# Altium project Feeder.PrjPcb (part 2 of 2)

## Sheet 07_Power_Supply_AC_to_DC.SchDoc
size A; SheetNumber: 7; SheetTotal: 8
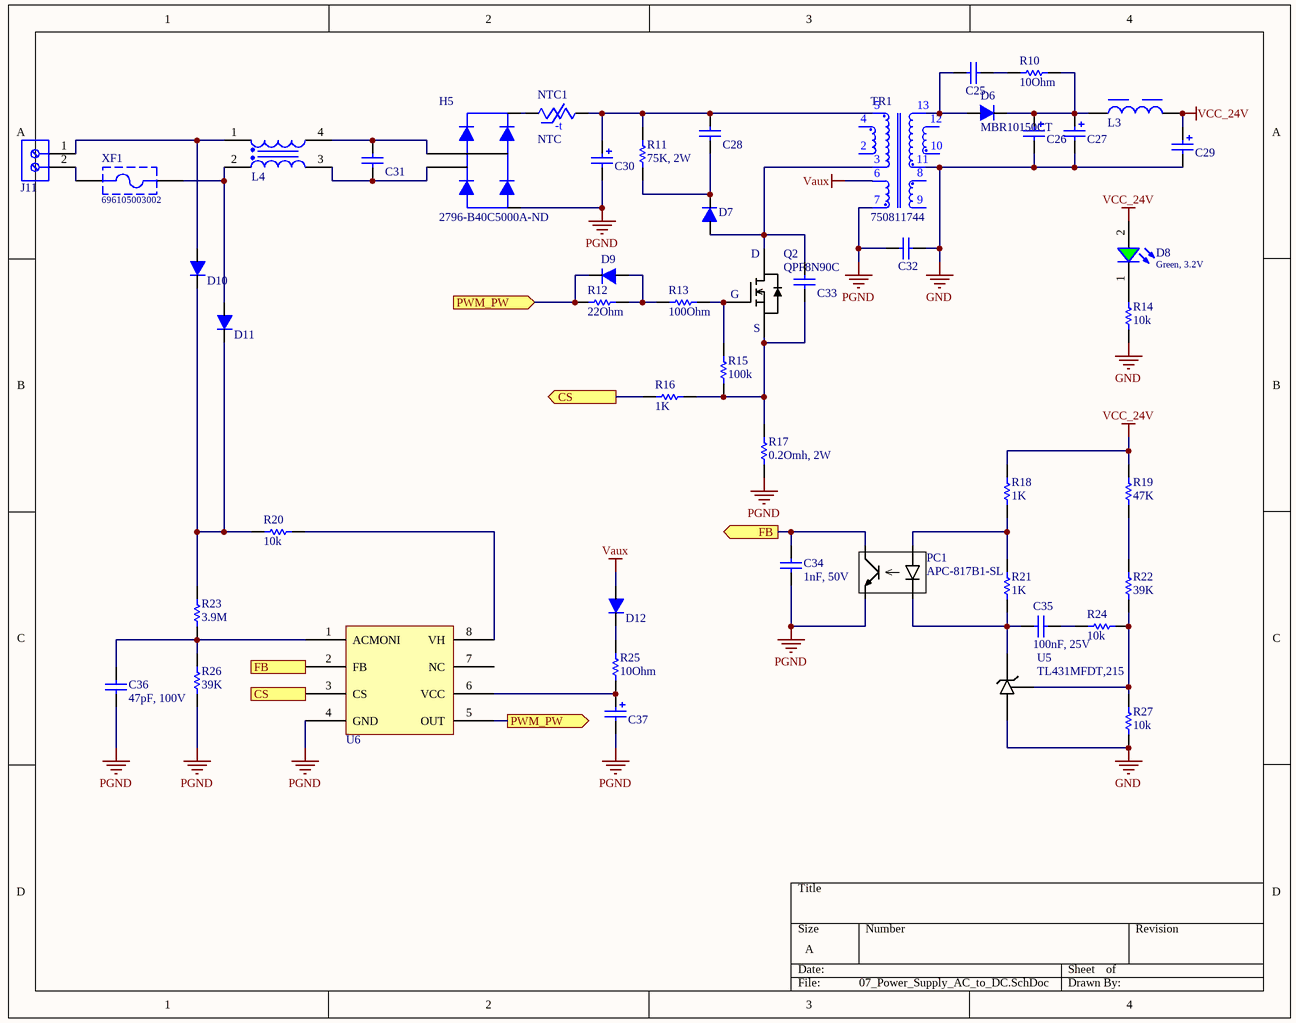
[diagram p6: 07_Power_Supply_AC_to_DC.SchDoc]

### Parts
C25  1nF  [WCAP-CSMH_0805_L2W1.25H0.8_Reflow]  (value not drawn)
C26  1200uF  [WCAP-ATG8_D16H31.5]  (value not drawn)
C27  1200uF  [WCAP-ATG8_D16H31.5]  (value not drawn)
C28  4.7nF  [WCAP-CSMH_1206_L3.2W1.6H1.25]  (value not drawn)
C29  100uF  [WCAP-ATG8_D8H11.5]  (value not drawn)
C30  220uF  [WCAP-AI3H_D22H50]  (value not drawn)
C31  2.2uF  [WCAP-FTX2_L26W15H25]  (value not drawn)
C32  2.2nF  [WCAP-CSSA_2211_L5.7W2.8H2.5]  (value not drawn)
C33  22pF  [WCAP-CSMH_1210_L3.2W2.5H0.95]  (value not drawn)
C34  1nF, 50V  [WCAP-CSGP_0805_H=0.8mm_Reflow]
C35  100nF, 25V  [WCAP-CSGP_0805_H=0.8mm_Reflow]
C36  47pF, 100V  [WCAP-CSGP_0805_H=0.6mm_Reflow]
C37  10uF  [WCAP-ATG8_D5H11]  (value not drawn)
D6  MBR10150CT  [MBR10150CT]
D7  RS1M-13-F  [SMA]  (value not drawn)
D8  Green, 3.2V  [WL-SMCW_0603_H=0.7mm]
D9  CDBA360-HF  [SMA]  (value not drawn)
D10  RFU02VSM8STR  [Flat Lead]  (value not drawn)
D11  RFU02VSM8STR  [Flat Lead]  (value not drawn)
D12  RS1M-13-F  [SMA]  (value not drawn)
H5  2796-B40C5000A-ND  [GBJ-4]
J11  691137710002  [691137710002]  (value not drawn)
L3  10µH, 7A  [WE-LHMI_1040]  (value not drawn)
L4  13mH  [WE-FC_UT20V]  (value not drawn)
NTC1  NTC  [NTC]
PC1  APC-817B1-SL  [APC-817B1-SL]
Q2  QPF8N90C  [FQPF8N90C]
R10  value 10Ohm  [RES-SM-2512]  (hidden comment: RK73H3ATTE10R0D)
R11  value 75K, 2W  [RES-SM-2512]  (hidden comment: 352175KFT)
R12  value 22Ohm  [RES-SM-0805]  (hidden comment: RK73H2ATTD22R0F)
R13  value 100Ohm  [RES-SM-0805]  (hidden comment: RK73B2ATTD101J)
R14  value 10k  [RES-SM-0805]  (hidden comment: RK73H2ATTD1002F)
R15  value 100k  [RES-SM-0805]  (hidden comment: RK73H2ATTD1003F)
R16  value 1K  [RES-SM-0805]  (hidden comment: RK73B2ATTD102J)
R17  value 0.2Omh, 2W  [RES-SM-2010]  (hidden comment: WFMB2010R2000FEA)
R18  value 1K  [RES-SM-0805]  (hidden comment: RK73B2ATTD102J)
R19  value 47K  [RES-SM-0805]  (hidden comment: RK73B2ATTD473J)
R20  value 10k  [RES-SM-0805]  (hidden comment: RK73H2ATTD1002F)
R21  value 1K  [RES-SM-0805]  (hidden comment: RK73B2ATTD102J)
R22  value 39K  [RES-SM-0805]  (hidden comment: RK73B2ATTD393J)
R23  value 3.9M  [RES-SM-0805]  (hidden comment: RK73B2ATTD395J)
R24  value 10k  [RES-SM-0805]  (hidden comment: RK73H2ATTD1002F)
R25  value 10Ohm  [RES-SM-0805]  (hidden comment: RK73H2ATTD10R0F)
R26  value 39K  [RES-SM-0805]  (hidden comment: RK73B2ATTD393J)
R27  value 10k  [RES-SM-0805]  (hidden comment: RK73H2ATTD1002F)
TR1  750811744  [750811744]
U5  TL431MFDT,215  [TO-236AB]
U6  BM1P061FJ-E2  [SOP-J8]  (value not drawn)
XF1  696105003002  [696105003002]

### Ports
CS (in), CS (out), FB (in), FB (out), PWM_PW (in), PWM_PW (out)

### Nets
GND: C26.2(N) C27.2(N) C29.2(N) C32.1 R14.2 R27.2 TR1.11 U5.3
PGND: C30.2(N) C32.2 C34.1 C36.1 C37.2(N) H5.4(-) PC1.3 R17.1 R26.1 TR1.7 U6.4(GND)
Vaux: D12.1(A) TR1.6
VCC_24V: C29.1(P) D8.2(A) L3.2 R18.1 R19.2
NetC25_1: C25.1 D6.1(A) TR1.13
NetC25_2: C25.2 R10.1
NetC26_1: C26.1(P) C27.1(P) D6.2(K) L3.1 R10.2
NetC28_1: C28.1 D7.2(K) R11.1
NetC28_2: C28.2 C30.1(P) NTC1.2 R11.2 TR1.5
NetC31_1: C31.1 H5.3 L4.3
NetC31_2: C31.2 H5.2 L4.4
NetC33_1: C33.1 Q2.3(S) R15.1 R16.1 R17.2
NetC33_2: C33.2 D7.1(A) Q2.2(D) TR1.3
NetC34_2: C34.2 PC1.4 U6.2(FB) ; port FB
NetC35_1: C35.1 PC1.2 R21.2 U5.1
NetC35_2: C35.2 R24.1
NetC36_2: C36.2 R23.1 R26.2 U6.1(ACMONI)
NetC37_1: C37.1(P) R25.1 U6.6(VCC)
NetD8_1: D8.1(K) R14.1
NetD9_1: D9.1(A) R12.2 R13.1
NetD9_2: D9.2(K) R12.1 U6.5(OUT) ; port PWM_PW
NetD10_1: D10.1(A) J11.1 L4.1
NetD10_2: D10.2(K) D11.2(K) R20.2 R23.2
NetD11_1: D11.1(A) L4.2 XF1.2
NetD12_2: D12.2(K) R25.2
NetH5_1: H5.1(+) NTC1.1
NetJ11_2: J11.2 XF1.1
NetPC1_1: PC1.1 R18.2 R21.1
NetQ2_1: Q2.1(G) R13.2 R15.2
NetR16_2: R16.2 U6.3(CS) ; port CS
NetR19_1: R19.1 R22.2
NetR20_1: R20.1 U6.8(VH)
NetR22_1: R22.1 R24.2 R27.1 U5.2

Not connected (* = marked no-connect by the designer): TR1 2 4 8 9 10 12; U6 7(NC)

### Notes on the sheet
- (in symbol NTC) -t

### Library data of the parts
C25 = 885342207013: WCAP-CSMH Multilayer Ceramic Chip Capacitor, Mid and High Voltage, size 0805, X7R Class II, 1nF, 500; Manufacturer: Wurth Elektronik; Case/Size Code: 0805; Capacitance Tolerance: 10%; Dissipation Factor: 2.5%; Insulation Resistance: 10GΩ; Rated Voltage (DC): 500V; Technical Reference: X7R0805102K500DFCT10000; No. Pad (SMD): 2; No. Pad (THT): 0; ComponentLink1Description: Website Link; ComponentLink1URL: https://www.we-online.com/redexpert/article/885342207013?ad; ComponentLink2Description: Datasheet Link; ComponentLink2URL: https://www.we-online.com/redexpert/spec/885342207013?ad; Manufacturer Part Number: 885342207013; Category: Multilayer Ceramic Chip Capacitors; Match Code: WCAP-CSMH; Mount: Surface Mount; Operating Temperature Max: 125°C; Operating Temperature Min: -55°C; Packaging: Tape and Reel; Length: 2mm; Width: 1.25mm; Height: 0.8mm; Capacitance: 1nF; Ceramic Type: X7R Class II; Unit Price (Digikey): 0.1
C26 C27 = 860010780025: WCAP-ATG8 Aluminum Electrolytic Capacitor, Radial THT, D16xH31.5mm, 1200uF, 63V; Manufacturer: Wurth Elektronik; Capacitance Tolerance: +/-20%; Dissipation Factor: 9%; Endurance: 2000h; Leakage Current: 756uA; Ripple Current: 1837mA; Technical Reference: ATBK315122M063DSPADB000; No. Pad (SMD): 0; No. Pad (THT): 2; ComponentLink1Description: Manufacturer Link; ComponentLink1URL: https://www.we-online.com/redexpert/article/860010780025?ad; ComponentLink2Description: Datasheet; ComponentLink2URL: https://www.we-online.com/redexpert/spec/860010780025?ad; Category: Aluminum Electrolytic Capacitors; Match Code: WCAP-ATG8; Manufacturer Part Number: 860010780025; Mount: Through Hole; Operating Temperature Max: 85°C; Operating Temperature Min: -40°C; Packaging: Ammo Pack; Height: 31.5mm; Diameter: 16mm; Capacitance: 1200uF; Rated Voltage (DC): 63V; Unit Price (Digikey): 2.81
C28 = 885342208008: WCAP-CSMH Multilayer Ceramic Chip Capacitor, Mid and High Voltage, size 1206, X7R Class II, 4.7nF, 5; Manufacturer: Wurth Elektronik; Case/Size Code: 1206; Capacitance Tolerance: 10%; Dissipation Factor: 2.5%; Insulation Resistance: 10GΩ; Rated Voltage (DC): 500V; Technical Reference: X7R1206472K500DFCT10000; No. Pad (SMD): 0; No. Pad (THT): 2; ComponentLink1Description: Website Link; ComponentLink1URL: https://www.we-online.com/redexpert/article/885342208008?ad; ComponentLink2Description: Datasheet Link; ComponentLink2URL: https://www.we-online.com/redexpert/spec/885342208008?ad; Manufacturer Part Number: 885342208008; Category: Multilayer Ceramic Chip Capacitors; Match Code: WCAP-CSMH; Mount: Surface Mount; Operating Temperature Max: 125°C; Operating Temperature Min: -55°C; Packaging: Tape and Reel; Length: 3.2mm; Width: 1.6mm; Height: 1.25mm; Capacitance: 4.7nF; Ceramic Type: X7R Class II; Unit Price (Digikey): 0.14
C29 = 860010674014: WCAP-ATG8 Aluminum Electrolytic Capacitor, Radial THT, D8xH11.5mm, 100uF, 50V; Manufacturer: Wurth Elektronik; Capacitance Tolerance: +/-20%; Dissipation Factor: 10%; Endurance: 2000h; Leakage Current: 50uA; Ripple Current: 286mA; Technical Reference: ATBE115101M050DSPA7B000; No. Pad (SMD): 0; No. Pad (THT): 2; ComponentLink1Description: Manufacturer Link; ComponentLink1URL: https://www.we-online.com/redexpert/article/860010674014?ad; ComponentLink2Description: Datasheet; ComponentLink2URL: https://www.we-online.com/redexpert/spec/860010674014?ad; Category: Aluminum Electrolytic Capacitors; Match Code: WCAP-ATG8; Manufacturer Part Number: 860010674014; Mount: Through Hole; Operating Temperature Max: 85°C; Operating Temperature Min: -40°C; Packaging: Ammo Pack; Height: 11.5mm; Diameter: 8mm; Capacitance: 100uF; Rated Voltage (DC): 50V; Unit Price (Digikey): 0.28
C30 = 861141483007: WCAP-AI3H Aluminum Electrolytic Capacitor, Snap-In, D22xH50mm, 220uF, 450V; Manufacturer: Wurth Elektronik; Capacitance Tolerance: +/-20%; Dissipation Factor: 20%; Endurance: 3000h; Leakage Current: 943.93uA; Ripple Current: 1000mA; Technical Reference: ANJN500221M450DSIC3C000; No. Pad (SMD): 0; No. Pad (THT): 2; ComponentLink1Description: Manufacturer Link; ComponentLink1URL: https://www.we-online.com/redexpert/article/861141483007?ad; ComponentLink2Description: Datasheet; ComponentLink2URL: https://www.we-online.com/redexpert/spec/861141483007?ad; Category: Aluminum Electrolytic Capacitors; Match Code: WCAP-AI3H; Manufacturer Part Number: 861141483007; Mount: Through Hole; Operating Temperature Max: 105°C; Operating Temperature Min: -25°C; Packaging: Tray; Height: 50mm; Diameter: 22mm; Capacitance: 220uF; Rated Voltage (DC): 450V; Unit Price (Digikey): 9.35
C31 = 890324026034: WCAP-FTX2 Film Capacitor, THT, L26W15H25mm, 2.2uF, 275VAC; Manufacturer: Wurth Elektronik; Capacitance Tolerance: +/-10%; Dissipation Factor @1kHz: 0.1%; Dissipation Factor @10kHz: 0.7%; Insulation Resistance: 10000Ohm x F; Pitch: 22.5mm; Rate of Voltage Rise: 170V/us; Rated Voltage (AC): 275V; Technical Reference: MX2P225225K275ASPB46000; No. Pad (SMD): 0; No. Pad (THT): 4; ComponentLink1Description: Manufacturer Link; ComponentLink1URL: https://www.we-online.com/redexpert/article/890324026034?ad; ComponentLink2Description: Datasheet; ComponentLink2URL: https://www.we-online.com/redexpert/spec/890324026034?ad; Category: Film Capacitors; Match Code: WCAP-FTX2; Manufacturer Part Number: 890324026034; Mount: Through Hole; Operating Temperature Max: 105°C; Operating Temperature Min: -40°C; Packaging: Carton; Length: 26mm; Width: 15mm; Height: 25mm; Capacitance: 2.2uF; Unit Price (Digikey): 3.2
C32 = 8853522130151: WCAP-CSSA Multilayer Ceramic Chip Safety Capacitor, 2211, X7R Class II, X1/Y2, 2.2nF, 250VAC; Manufacturer: Wurth Elektronik; Case/Size Code: 2211; Capacitance Tolerance: +/-10%; Dissipation Factor: 2.5%; Impulse Voltage: 5000VDC; Insulation Resistance: 10GOhm; Rated Voltage (AC): 250V; Technical Reference: X7R2211222KE00IFCT1B000; No. Pad (SMD): 2; No. Pad (THT): 0; ComponentLink1Description: Manufacturer Link; ComponentLink1URL: https://www.we-online.com/redexpert/article/8853522130151?ad; ComponentLink2Description: Datasheet; ComponentLink2URL: https://www.we-online.com/redexpert/spec/8853522130151?ad; Category: Multilayer Ceramic Chip Capacitors; Match Code: WCAP-CSSA; Manufacturer Part Number: 8853522130151; Mount: Surface Mount; Operating Temperature Max: 125°C; Operating Temperature Min: -55°C; Packaging: Tape and Reel; Length: 5.7mm; Width: 2.8mm; Height: 2.5mm; Capacitance: 2.2nF; Ceramic Type: X7R Class II; Safety Class: X1/Y2; Unit Price (Digikey): 3.04
C33 = 885342009002: WCAP-CSMH Multilayer Ceramic Chip Capacitor, Mid and High Voltage, size 1210, NP0 Class I, 22pF, 100; Manufacturer: Wurth Elektronik; Case/Size Code: 1210; Capacitance Tolerance: 5%; Insulation Resistance: 10GΩ; Q Factor: 840; Rated Voltage (DC): 1000V; Technical Reference: NP01210220JA00DFCT10000; No. Pad (SMD): 2; No. Pad (THT): 0; ComponentLink1Description: Website Link; ComponentLink1URL: https://www.we-online.com/redexpert/article/885342009002?ad; ComponentLink2Description: Datasheet Link; ComponentLink2URL: https://www.we-online.com/redexpert/spec/885342009002?ad; Manufacturer Part Number: 885342009002; Category: Multilayer Ceramic Chip Capacitors; Match Code: WCAP-CSMH; Mount: Surface Mount; Operating Temperature Max: 125°C; Operating Temperature Min: -55°C; Packaging: Tape and Reel; Length: 3.2mm; Width: 2.5mm; Height: 0.95mm; Capacitance: 22pF; Ceramic Type: NP0 Class I; Unit Price (Digikey): 0.85
C34 = 885012007063: WCAP-CSGP Multilayer Ceramic Chip Capacitor, General Purpose, size 0805, NP0, 1nF, 50V; Manufacturer: Wurth Elektronik; Rated Voltage: 50VDC; Isolation Resistance: >=10GOhm; Capacitance Tolerance: +/-5%; Dissipation Factor: Q>=1000; Technical Reference: NP00805102J050DFCT10000; No. Pad (SMD): 2; No. Pad (THT): 0; ComponentLink1Description: Manufacturer; ComponentLink1URL: http://www.we-online.de; ComponentLink2Description: Datasheet; ComponentLink2URL: https://www.we-online.com/catalog/datasheet/885012007063.pdf; Operating Temperature: -55 to +125degC; Packaging: Tape and Reel; Manufacturer Part Number: 885012007063; Published Date: May 2020; Ceramic Type: NP0; Height: 0.8mm; Mounting Technology: SMT; Size: 0805; Capacitance: 1nF; Unit Price (Digikey): 0.1
C35 = 885012207072: WCAP-CSGP Multilayer Ceramic Chip Capacitor, General Purpose, size 0805, X7R, 100nF, 25V; Manufacturer: Wurth Elektronik; Rated Voltage: 25VDC; Isolation Resistance: >=5GOhm; Capacitance Tolerance: +/-10%; Technical Reference: X7R0805104K025DFCT10000; No. Pad (SMD): 2; No. Pad (THT): 0; ComponentLink1Description: Manufacturer; ComponentLink1URL: http://www.we-online.de; ComponentLink2Description: Datasheet; ComponentLink2URL: https://www.we-online.com/catalog/datasheet/885012207072.pdf; Operating Temperature: -55 to +125degC; Packaging: Tape and Reel; Manufacturer Part Number: 885012207072; Published Date: May 2020; Ceramic Type: X7R; Dissipation Factor: =<3.5%; Height: 0.8mm; Mounting Technology: SMT; Size: 0805; Capacitance: 100nF; Unit Price (Digikey): 0.1
C36 = 885012007080: WCAP-CSGP Multilayer Ceramic Chip Capacitor, General Purpose, size 0805, NP0, 47pF, 100V; Manufacturer: Wurth Elektronik; Rated Voltage: 100VDC; Isolation Resistance: >=10GOhm; Capacitance Tolerance: +/-5%; Dissipation Factor: Q>=1000; Technical Reference: NP00805470J100DFCT10000; No. Pad (SMD): 2; No. Pad (THT): 0; ComponentLink1Description: Manufacturer; ComponentLink1URL: http://www.we-online.de; ComponentLink2Description: Datasheet; ComponentLink2URL: https://www.we-online.com/catalog/datasheet/885012007080.pdf; Operating Temperature: -55 to +125degC; Packaging: Tape and Reel; Manufacturer Part Number: 885012007080; Published Date: May 2020; Ceramic Type: NP0; Height: 0.6mm; Mounting Technology: SMT; Size: 0805; Capacitance: 47pF; Unit Price (Digikey): 0.1
C37 = 860010672009: WCAP-ATG8 Aluminum Electrolytic Capacitor, Radial THT, D5xH11mm, 10uF, 50V; Manufacturer: Wurth Elektronik; Capacitance Tolerance: +/-20%; Dissipation Factor: 10%; Endurance: 2000h; Leakage Current: 5uA; Ripple Current: 72mA; Technical Reference: ATBC110100M050DSPA3B000; No. Pad (SMD): 0; No. Pad (THT): 2; ComponentLink1Description: Manufacturer Link; ComponentLink1URL: https://www.we-online.com/redexpert/article/860010672009?ad; ComponentLink2Description: Datasheet; ComponentLink2URL: https://www.we-online.com/redexpert/spec/860010672009?ad; Category: Aluminum Electrolytic Capacitors; Match Code: WCAP-ATG8; Manufacturer Part Number: 860010672009; Mount: Through Hole; Operating Temperature Max: 85°C; Operating Temperature Min: -40°C; Packaging: Ammo Pack; Height: 11mm; Diameter: 5mm; Capacitance: 10uF; Rated Voltage (DC): 50V; Unit Price (Digikey): 0.12
D6 = Diode: DIODE ARRAY SCHOTTKY 150V TO220; Mfr: SMC Diode Solutions; No. Pad (SMD): 0; No. Pad (THT): 3; Diode Configuration: 1 Pair Common Cathode; Current - Average Rectified (Io) (per Diode): 5A; Voltage - Forward (Vf) (Max) @ If: 930 mV @ 5 A; Speed: Fast Recovery =< 500ns, > 200mA (Io); Current - Reverse Leakage @ Vr: 1 mA @ 150 V; Unit Price (Digikey): 0.74; Category: Discrete Semiconductor Products; Diode Type: Schottky; Voltage - DC Reverse (Vr) (Max): 150 V; Operating Temperature - Junction: -55°C ~ 150°C; Mounting Type: Through Hole; Package / Case: TO-220-3; Supplier Device Package: TO-220AB; Base Product Number: MBR10150; ComponentLink1Description: Digikey; ComponentLink1URL: https://www.digikey.com/en/products/detail/smc-diode-solutions/MBR10150CT/6022107
D7 D12 = Diode: DIODE GEN PURP 1KV 1A SMA; Mfr: Diodes Incorporated; Diode Type: Standard; Voltage - DC Reverse (Vr) (Max): 1000V; Voltage - Forward (Vf) (Max) @ If: 1.3 V @ 1 A; Speed: Fast Recovery =< 500ns, > 200mA (Io); Reverse Recovery Time (trr): 500 ns; Current - Reverse Leakage @ Vr: 5 µA @ 1000 V; Capacitance @ Vr, F: 15pF @ 4V, 1MHz; Base Product Number: RS1M; No. Pad (SMD): 2; No. Pad (THT): 0; Category: Discrete Semiconductor Products; Current - Average Rectified (Io): 1A; Mounting Type: Surface Mount; Package / Case: DO-214AC, SMA; ComponentLink1Description: Digikey; ComponentLink1URL: https://www.digikey.com/en/products/detail/diodes-incorporated/RS1M-13-F/775742?s=N4IgTCBcDaIEoGUCMBZAtEgzGgYiAugL5A; Unit Price (Digikey): 0.5
D8 = 150060GS75000: WL-SMCW SMT Mono-color Chip LED Waterclear, size 0603, Green, 3.2V, 140deg; Chip Technology: InGaN; Dominant Wavelength typ.: 525nm; Luminous Intensity typ.: 430mcd; Peak Wavelength typ.: 515nm; No. Pad (SMD): 2; No. Pad (THT): 0; Viewing Angle: 140deg; ComponentLink1Description: Manufacturer; ComponentLink1URL: http://www.we-online.de; ComponentLink2URL: https://www.we-online.com/catalog/datasheet/150060GS75000.pdf; ComponentLink2Description: Datasheet; Forward Voltage typ.: 3.2V; Emitting Color: Green; Mounting Technology: SMT; Operating Temperature: -40 to +85degC; Published Date: December 2019; Part Number: 150060GS75000; Packaging: Tape and Reel; Size: 0603; Publisher: Wurth Elektronik; Unit Price (Digikey): 0.15
D9 = Diode: DIODE SCHOTTKY 60V 3A DO214AC; Mfr: Comchip Technology; Voltage - Forward (Vf) (Max) @ If: 700 mV @ 3 A; Speed: Fast Recovery =< 500ns, > 200mA (Io); Current - Reverse Leakage @ Vr: 500 µA @ 60 V; Capacitance @ Vr, F: 250pF @ 4V, 1MHz; No. Pad (SMD): 2; No. Pad (THT): 0; Category: Discrete Semiconductor Products; Diode Type: Schottky; ComponentLink1Description: Digikey; ComponentLink1URL: https://www.digikey.com/en/products/detail/comchip-technology/CDBA360-HF/5226173; Voltage - DC Reverse (Vr) (Max): 60 V; Current - Average Rectified (Io): 3A; Package / Case: DO-214AC, SMA; Operating Temperature - Junction: -50°C ~ 150°C; Base Product Number: CDBA360; Unit Price (Digikey): 0.39
D10 D11 = Diode: DIODE GP 800V 200MA TUMD2SM; Mfr: Rohm Semiconductor; Diode Type: Standard; Voltage - Forward (Vf) (Max) @ If: 3 V @ 200 mA; Speed: Small Signal =< 200mA (Io), Any Speed; Reverse Recovery Time (trr): 25 ns; Current - Reverse Leakage @ Vr: 10 µA @ 800 V; Capacitance @ Vr, F: 4pF @ 0V, 1MHz; Base Product Number: RFU02; No. Pad (SMD): 2; No. Pad (THT): 0; Category: Discrete Semiconductor Products; Voltage - DC Reverse (Vr) (Max): 800 V; Current - Average Rectified (Io): 200mA; ComponentLink1Description: Digikey; ComponentLink1URL: https://www.digikey.com/en/products/detail/rohm-semiconductor/RFU02VSM8STR/5113962; Mounting Type: Surface Mount; Package / Case: 2-SMD, Flat Lead; Operating Temperature - Junction: 150°C (Max); Unit Price (Digikey): 0.44
H5 = H Bridge: Bridge Rectifier Single Phase Standard 80 V Through Hole 4-SIP; Voltage - Peak Reverse (Max): 80 V; Current - Average Rectified (Io): 4 A; Voltage - Forward (Vf) (Max) @ If: 1 V @ 5 A; Current - Reverse Leakage @ Vr: 5 µA @ 80 V; No. Pad (SMD): 0; No. Pad (THT): 4; Diode Type: Single Phase; Technology: Standard; Operating Temperature: -50°C ~ 150°C (TJ); Mounting Type: Through Hole; Package / Case: 4-SIP; Supplier Device Package: 4-SIP; ComponentLink1Description: Digikey; ComponentLink1URL: https://www.digikey.com/en/products/detail/diotec-semiconductor/B40C5000A/13155422; Unit Price (Digikey): 1.36
J11 = 691137710002: WR-TBL Series 1377 Horizontal Entry, Through Hole, pitch 5mm, 2p; Manufacturer: Wurth Elektronik; Pin Number: 2; Rated Current: 16A; Working Voltage: 300V; PCB/Cable/Panel: PCB; Modularity: No; No. Pad (SMD): 0; ComponentLink1Description: Manufacturer Link; ComponentLink1URL: https://www.we-online.com/redexpert/article/691137710002?ad; ComponentLink2Description: Datasheet; ComponentLink2URL: https://www.we-online.com/redexpert/spec/691137710002?ad; Category: Terminal Blocks; Match Code: WR-TBL; Manufacturer Part Number: 691137710002; Mount: Through Hole; Operating Temperature Max: 120°C; Operating Temperature Min: -30°C; Packaging: Box; Pitch: 5mm; Orientation: Horizontal; Application: Pressure Clamp; No. Pad (THT): 2; Unit Price (Digikey): 0.41
L3 = 74437368100: WE-LHMI SMT Power Inductor, size 1040, 10µH, 7A, 30mΩ; Manufacturer: Wurth Elektronik; Case/Size Code: 1040; DC Resistance: 27mΩ; Saturation Current @10%: 7.9A; Saturation Current @30%: 16.8A; Self Resonant Frequency: 12MHz; No. Pad (SMD): 2; No. Pad (THT): 0; ComponentLink1Description: Website Link; ComponentLink1URL: https://www.we-online.com/redexpert/article/74437368100?ad; ComponentLink2Description: Datasheet Link; ComponentLink2URL: https://www.we-online.com/redexpert/spec/74437368100?ad; Manufacturer Part Number: 74437368100; Category: Shielded Power Inductors; Match Code: WE-LHMI; Mount: Surface Mount; Operating Temperature Max: 125°C; Operating Temperature Min: -40°C; Packaging: Tape and Reel; Length: 10mm; Width: 10mm; Height: 3.8mm; DC Resistance Max: 30mΩ; Inductance: 10µH; Performance Rated Current: 7A; Unit Price (Digikey): 2.57
L4 = 7448640415: WE-FC THT Common Mode Power Line Choke, UT20V, 13mH, 0.8A, 0.708Ω; Manufacturer: Wurth Elektronik; Insulation Test Voltage (AC): 2000V; Material: MnZn; Rated Voltage (AC): 250V; No. Pad (SMD): 0; No. Pad (THT): 4; ComponentLink1Description: Website Link; ComponentLink1URL: https://www.we-online.com/redexpert/article/7448640415?ad; ComponentLink2Description: Datasheet Link; ComponentLink2URL: https://www.we-online.com/redexpert/spec/7448640415?ad; Manufacturer Part Number: 7448640415; Category: Common Mode Chokes; Match Code: WE-FC; Mount: Through Hole; Operating Temperature Max: 125°C; Operating Temperature Min: -40°C; Packaging: Tray; Case/Size Code: UT20V; Length: 21.3mm; Width: 16.6mm; Height: 22.5mm; DC Resistance: 0.708Ω; Inductance: 13mH; Rated Current: 0.8A; Unit Price (Digikey): 2.07
NTC1 = NTC: THERMISTOR NTC 15OHM 3000K; Mfr: EPCOS - TDK Electronics; Product Status: Active; R @ 25°C: 15 Ohms; Tolerance: ±20%; Current - Steady State Max: 4 A; Approval Agency: UL; No. Pad (SMD): 0; No. Pad (THT): 2; Category: Circuit Protection; Series: S234; Package: Bulk; Diameter: 0.591" (15.00mm); Lead Spacing: 0.295" (7.50mm); ComponentLink1Description: New link; ComponentLink1URL: *; Unit Price (Digikey): 2.1
PC1 = Opto Isolator: DIP4, DC INPUT, PHOTO TRANSISTOR; Mfr: American Bright Optoelectronics Corporation; Number of Channels: 1; Voltage - Isolation: 5000Vrms; Current Transfer Ratio (Min): 130% @ 5mA; Current Transfer Ratio (Max): 260% @ 5mA; Rise / Fall Time (Typ): 3µs, 4µs; Voltage - Output (Max): 35V; Current - Output / Channel: 50mA; Voltage - Forward (Vf) (Typ): 1.24V; Current - DC Forward (If) (Max): 60 mA; Vce Saturation (Max): 200mV; No. Pad (SMD): 4; No. Pad (THT): 0; Category: Isolators; Series: APC-817; Input Type: DC; Output Type: Transistor; Operating Temperature: -55°C ~ 110°C; Package / Case: 4-SMD, Gull Wing; Base Product Number: APC-817; ComponentLink1Description: Digikey; ComponentLink1URL: https://www.digikey.com/en/products/detail/american-bright-optoelectronics-corporation/APC-817B1-SL/16273138?s=N4IgTCBcDaIIIAUDCAOAjAdgLQCE1YGUAZEAXQF8g; Unit Price (Digikey): 0.45
Q2 = Mosfet: N-Channel 900 V 6.3A (Tc) 60W (Tc) Through Hole TO-220F-3; Mfr: onsemi; No. Pad (SMD): 0; No. Pad (THT): 3; Drain to Source Voltage (Vdss): 900 V; Drive Voltage (Max Rds On, Min Rds On): 10V; Rds On (Max) @ Id, Vgs: 1.9Ohm @ 3.15A, 10V; Vgs(th) (Max) @ Id: 5V @ 250µA; Gate Charge (Qg) (Max) @ Vgs: 45 nC @ 10 V; Vgs (Max): ±30V; Input Capacitance (Ciss) (Max) @ Vds: 2080 pF @ 25 V; Base Product Number: FQPF8; Unit Price (Digikey): 2.76; Series: QFET®; ComponentLink1Description: Mouser; ComponentLink1URL: https://www.mouser.vn/ProductDetail/onsemi-Fairchild/FQPF8N90C?qs=72dMl1E%2FA7cBeynBTktkIg%3D%3D; FET Type: N-Channel; Technology: MOSFET (Metal Oxide); Current - Continuous Drain (Id) @ 25°C: 6.3A (Tc); Power Dissipation (Max): 60W (Tc); Operating Temperature: -55°C ~ 150°C (TJ); Mounting Type: Through Hole; Supplier Device Package: TO-220F-3; Package / Case: TO-220-3 Full Pack
R10 = RESISTOR SMD: RES 10 OHM 0.5% 1W 2512; Mfr: KOA Speer Electronics, Inc.; Resistance: 10 Ohms; Tolerance: ±5%; Temperature Coefficient: ±100ppm/°C; No. Pad (SMD): 2; No. Pad (THT): 0; Category: Resistors; Series: RK73H; Power (Watts): 1W; Composition: Thick Film; Features: Automotive AEC-Q200, Moisture Resistant; Operating Temperature: -55°C ~ 155°C; Package / Case: 2512 (6432 Metric); Ratings: AEC-Q200; Size / Dimension: 0.248" L x 0.122" W (6.30mm x 3.10mm); Base Product Number: RK73H3A; ComponentLink1Description: Digikey; ComponentLink1URL: https://www.digikey.com/en/products/detail/koa-speer-electronics-inc/RK73B3ATTE100J/10425243; Unit Price (Digikey): 0.38
R11 = RESISTOR SMD: RES SMD 75K OHM 1% 2W 2512; Mfr: TE Connectivity Passive Product; Resistance: 75 kOhms; Temperature Coefficient: ±100ppm/°C; No. Pad (SMD): 2; No. Pad (THT): 0; Category: Resistors; Series: 3521, CGS; Tolerance: ±1%; Power (Watts): 2W; Composition: Thick Film; Features: Automotive AEC-Q200; Operating Temperature: -55°C ~ 155°C; Package / Case: 2512 (6432 Metric); Ratings: AEC-Q200; Size / Dimension: 0.248" L x 0.126" W (6.30mm x 3.20mm); Height - Seated (Max): 0.026" (0.65mm); ComponentLink1Description: Digikey; ComponentLink1URL: https://www.digikey.com/en/products/detail/te-connectivity-passive-product/352175KFT/4279980?s=N4IgTCBcDaIMwFYwEYDsCDSAxAKiAugL5A; Unit Price (Digikey): 0.59
R12 = RESISTOR SMD: RES 22 OHM 1% 1/4W 0805; Mfr: KOA Speer Electronics, Inc.; Resistance: 22 Ohms; Power (Watts): 0.25W, 1/4W; Temperature Coefficient: ±100ppm/°C; No. Pad (SMD): 2; No. Pad (THT): 0; Category: Resistors; Series: RK73H; Tolerance: ±1%; Composition: Thick Film; Features: Automotive AEC-Q200, Moisture Resistant; Operating Temperature: -55°C ~ 155°C; ComponentLink1Description: Digikey; ComponentLink1URL: https://www.digikey.com/en/products/detail/koa-speer-electronics-inc/RK73H2ATTD22R0F/10234130?s=N4IgTCBcDaIEoGkDsBmAEmAggFWwETDDgAYAxEAXQF8g; Package / Case: 0805 (2012 Metric); Ratings: AEC-Q200; Size / Dimension: 0.079" L x 0.049" W (2.00mm x 1.25mm); Base Product Number: RK73H2A; ComponentLink2Description: New link; ComponentLink2URL: *; Unit Price (Digikey): 0.1
R13 = RESISTOR SMD: RES 100 OHM 5% 1/4W 0805; Mfr: KOA Speer Electronics, Inc.; Resistance: 100 Ohms; Power (Watts): 0.25W, 1/4W; Temperature Coefficient: ±200ppm/°C; No. Pad (SMD): 2; No. Pad (THT): 0; Category: Resistors; ComponentLink1Description: Digikey; ComponentLink1URL: https://www.digikey.com/en/products/detail/koa-speer-electronics-inc/RK73B2ATTD101J/10236510?s=N4IgTCBcDaIE4GsDsBmARmAhgF2wEwEYAGAgKxAF0BfIA; Series: RK73B; Tolerance: ±5%; Composition: Thick Film; Features: Automotive AEC-Q200; Operating Temperature: -55°C ~ 155°C; Package / Case: 0805 (2012 Metric); Size / Dimension: 0.079" L x 0.049" W (2.00mm x 1.25mm); Base Product Number: RK73B2A; Unit Price (Digikey): 0.1
R14 R20 R24 R27 = RESISTOR SMD: RES 10K OHM 1% 1/4W 0805; Mfr: KOA Speer Electronics, Inc.; Resistance: 10 kOhms; Power (Watts): 0.25W, 1/4W; Temperature Coefficient: ±100ppm/°C; No. Pad (SMD): 2; No. Pad (THT): 0; Category: Resistors; Series: RK73H; Tolerance: ±1%; Composition: Thick Film; Features: Automotive AEC-Q200, Moisture Resistant; Operating Temperature: -55°C ~ 155°C; Package / Case: 0805 (2012 Metric); Size / Dimension: 0.079" L x 0.049" W (2.00mm x 1.25mm); Base Product Number: RK73H2A; ComponentLink1Description: Digikey; ComponentLink1URL: https://www.digikey.com/en/products/detail/koa-speer-electronics-inc/RK73H2ATTD1002F/10234111; Unit Price (Digikey): 0.1
R15 = RESISTOR SMD: RES 100K OHM 1% 1/4W 0805; Mfr: KOA Speer Electronics, Inc.; No. Pad (SMD): 2; No. Pad (THT): 0; Resistance: 100 kOhms; Power (Watts): 0.25W, 1/4W; Temperature Coefficient: ±100ppm/°C; Unit Price (Digikey): 0.1; Category: Resistors; Series: RK73H; Tolerance: ±1%; Composition: Thick Film; Features: Automotive AEC-Q200, Moisture Resistant; Operating Temperature: -55°C ~ 155°C; Package / Case: 0805 (2012 Metric); Supplier Device Package: 0805; Ratings: AEC-Q200; Size / Dimension: 0.079" L x 0.049" W (2.00mm x 1.25mm); Height - Seated (Max): 0.024" (0.60mm); Number of Terminations: 2; Base Product Number: RK73H2A
R16 R18 R21 = RESISTOR SMD: RES 1K OHM 5% 1/4W 0805; Mfr: KOA Speer Electronics, Inc.; Resistance: 1 kOhms; Power (Watts): 0.25W, 1/4W; Temperature Coefficient: ±200ppm/°C; Base Product Number: RK73H2A; No. Pad (SMD): 2; No. Pad (THT): 0; Category: Resistors; Series: RK73H; Tolerance: ±5%; Composition: Thick Film; Features: Automotive AEC-Q200, Moisture Resistant; Operating Temperature: -55°C ~ 155°C; Package / Case: 0805 (2012 Metric); Size / Dimension: 0.079" L x 0.049" W (2.00mm x 1.25mm); ComponentLink1Description: Digikey; ComponentLink1URL: https://www.digikey.com/en/products/detail/koa-speer-electronics-inc/RK73H2ATTD1002F/10234111; Unit Price (Digikey): 0.1
R17 = RESISTOR SMD: RES 0.2 OHM 2.0 W 1% 2010 SMD; Mfr: Vishay Dale; Resistance: 200 mOhms; Power (Watts): 2W; Temperature Coefficient: ±50ppm/°C; No. Pad (SMD): 2; No. Pad (THT): 0; Category: Resistors; Series: WFM; Tolerance: ±1%; Composition: Metal Film; Features: Automotive AEC-Q200, Current Sense, Moisture Resistant; Operating Temperature: -65°C ~ 170°C; Package / Case: 2010 (5025 Metric); Size / Dimension: 0.200" L x 0.100" W (5.08mm x 2.54mm); ComponentLink1Description: Digikey; ComponentLink1URL: https://www.digikey.com/en/products/detail/vishay-dale/WFMB2010R2000FEA/9972271?s=N4IgTCBcDaIOoDECyAhMAGAjOgSh96CAogIIgC6AvkA; Unit Price (Digikey): 1.33
R19 = RESISTOR SMD: RES 47K OHM 5% 1/4W 0805; Mfr: KOA Speer Electronics, Inc.; Resistance: 47 kOhms; Power (Watts): 0.25W, 1/4W; Temperature Coefficient: ±400ppm/°C; No. Pad (SMD): 2; No. Pad (THT): 0; Category: Resistors; Series: RK73B; Tolerance: ±5%; Composition: Thick Film; Features: Automotive AEC-Q200; Operating Temperature: -55°C ~ 155°C; Package / Case: 0805 (2012 Metric); Ratings: AEC-Q200; Size / Dimension: 0.079" L x 0.049" W (2.00mm x 1.25mm); Height - Seated (Max): 0.024" (0.60mm); Base Product Number: RK73B2A; ComponentLink1Description: Digikey; ComponentLink1URL: https://www.digikey.com/en/products/detail/koa-speer-electronics-inc/RK73B2ATTD395J/10236524; Unit Price (Digikey): 0.1
R22 R26 = RESISTOR SMD: RES 39K OHM 5% 1/4W 0805; Mfr: KOA Speer Electronics, Inc.; Resistance: 39 KOhms; Power (Watts): 0.25W, 1/4W; Temperature Coefficient: ±400ppm/°C; No. Pad (SMD): 2; No. Pad (THT): 0; Category: Resistors; Series: RK73B; Tolerance: ±5%; Composition: Thick Film; Features: Automotive AEC-Q200; Operating Temperature: -55°C ~ 155°C; Package / Case: 0805 (2012 Metric); Ratings: AEC-Q200; Size / Dimension: 0.079" L x 0.049" W (2.00mm x 1.25mm); Height - Seated (Max): 0.024" (0.60mm); Base Product Number: RK73B2A; ComponentLink1Description: Digikey; ComponentLink1URL: https://www.digikey.com/en/products/detail/koa-speer-electronics-inc/RK73B2ATTD395J/10236524; Unit Price (Digikey): 0.1
R23 = RESISTOR SMD: RES 3.9M OHM 5% 1/4W 0805; Mfr: KOA Speer Electronics, Inc.; Resistance: 3.9 MOhms; Power (Watts): 0.25W, 1/4W; Temperature Coefficient: ±400ppm/°C; No. Pad (SMD): 2; No. Pad (THT): 0; Category: Resistors; Series: RK73B; Tolerance: ±5%; Composition: Thick Film; Features: Automotive AEC-Q200; Operating Temperature: -55°C ~ 155°C; Package / Case: 0805 (2012 Metric); Ratings: AEC-Q200; Size / Dimension: 0.079" L x 0.049" W (2.00mm x 1.25mm); Height - Seated (Max): 0.024" (0.60mm); Base Product Number: RK73B2A; ComponentLink1Description: Digikey; ComponentLink1URL: https://www.digikey.com/en/products/detail/koa-speer-electronics-inc/RK73B2ATTD395J/10236524; Unit Price (Digikey): 0.1
R25 = RESISTOR SMD: RES 10 OHM 1% 1/4W 0805; Mfr: KOA Speer Electronics, Inc.; Resistance: 10 Ohms; Power (Watts): 0.25W, 1/4W; Temperature Coefficient: ±100ppm/°C; No. Pad (SMD): 2; No. Pad (THT): 0; Category: Resistors; Series: RK73H; Tolerance: ±1%; Composition: Thick Film; Features: Automotive AEC-Q200, Moisture Resistant; Operating Temperature: -55°C ~ 155°C; Package / Case: 0805 (2012 Metric); Ratings: AEC-Q200; Size / Dimension: 0.079" L x 0.049" W (2.00mm x 1.25mm); Height - Seated (Max): 0.024" (0.60mm); Base Product Number: RK73H2A; ComponentLink1Description: Digikey; ComponentLink1URL: https://www.digikey.com/en/products/detail/koa-speer-electronics-inc/RK73H2ATTD10R0F/10234071; Unit Price (Digikey): 0.1
TR1 = 750811744: Flyback Converters For For DC/DC Converters SMPS Transformer 4000Vrms Isolation 80kHz Through Hole; Mfr: Würth Elektronik; Inductance @ Frequency: 450µH @ 10kHz; Voltage - Auxiliary: 14V @ 50mA; Voltage - Primary: 90 ~ 375V; No. Pad (SMD): 0; No. Pad (THT): 12; Height - Seated (Max): 1.200" (30.48mm); Size / Dimension: 1.559" L x 1.700" W (39.60mm x 43.18mm); Mounting Type: Through Hole; Frequency: 80kHz; Operating Temperature: -40°C ~ 125°C; Voltage - Isolation: 4000Vrms; Applications: Flyback Converters; Type: For DC/DC Converters; Package: Tray; Series: MID-OLON; Category: Transformers; Unit Price (Digikey): 9.17
U5 = IC Shunt: IC VREF SHUNT ADJ 2% TO236AB; Mfr: Nexperia USA Inc.; Output Type: Adjustable; Voltage - Output (Min/Fixed): 2.495V; Voltage - Output (Max): 36 V; Current - Output: 100 mA; Current - Cathode: 1 mA; Base Product Number: TL431; No. Pad (SMD): 3; No. Pad (THT): 0; Category: Integrated Circuits (ICs); Reference Type: Shunt; Tolerance: ±2%; Operating Temperature: -40°C ~ 125°C (TA); Mounting Type: Surface Mount; Package / Case: TO-236-3, SC-59, SOT-23-3; ComponentLink1Description: Digikey; ComponentLink1URL: https://www.digikey.com/en/products/detail/nexperia-usa-inc/TL431MFDT-215/2780405; Unit Price (Digikey): 0.41
U6 = IC PWM: IC OFFLINE SWITCH FLYBACK 8SOPJ; Mfr: Rohm Semiconductor; Output Isolation: Either; Internal Switch(s): No; Voltage - Start Up: 13.5 V; Voltage - Supply (Vcc/Vdd): 8.9V ~ 26V; Duty Cycle: 75%; Frequency - Switching: 65kHz; Fault Protection: Current Limiting, Over Voltage; No. Pad (SMD): 8; No. Pad (THT): 0; Category: Integrated Circuits (ICs); Topology: Flyback; Operating Temperature: -40°C ~ 85°C (TA); Package / Case: 8-SOIC (0.154", 3.90mm Width); Mounting Type: Surface Mount; Base Product Number: BM1P061; ComponentLink1Description: Digikey; ComponentLink1URL: https://www.digikey.com/en/products/detail/rohm-semiconductor/BM1P061FJ-E2/4625619?s=N4IgTCBcDaIEIFkCMAFADANiQMQFIgF0BfIA; Unit Price (Digikey): 1.59
XF1 = 696105003002: WR-FSH Fuseholder THT Blocks PCB Clip Cover; Manufacturer: Wurth Elektronik; Fuse Size: 5x20mm; No. Pad (SMD): 0; No. Pad (THT): 2; ComponentLink1Description: Manufacturer; ComponentLink1URL: http://www.we-online.de; ComponentLink2Description: Datasheet; ComponentLink2URL: https://www.we-online.com/catalog/datasheet/696105003002.pdf; Manufacturer Part Number: 696105003002; Published Date: March 2021; Operating Temperature: -30 to +120degC; Mounting Technology: THT; Packaging: Box; Unit Price (Digikey): 0.68

## Sheet 08_Power_Supply.SchDoc
size A; SheetNumber: 8; SheetTotal: 8
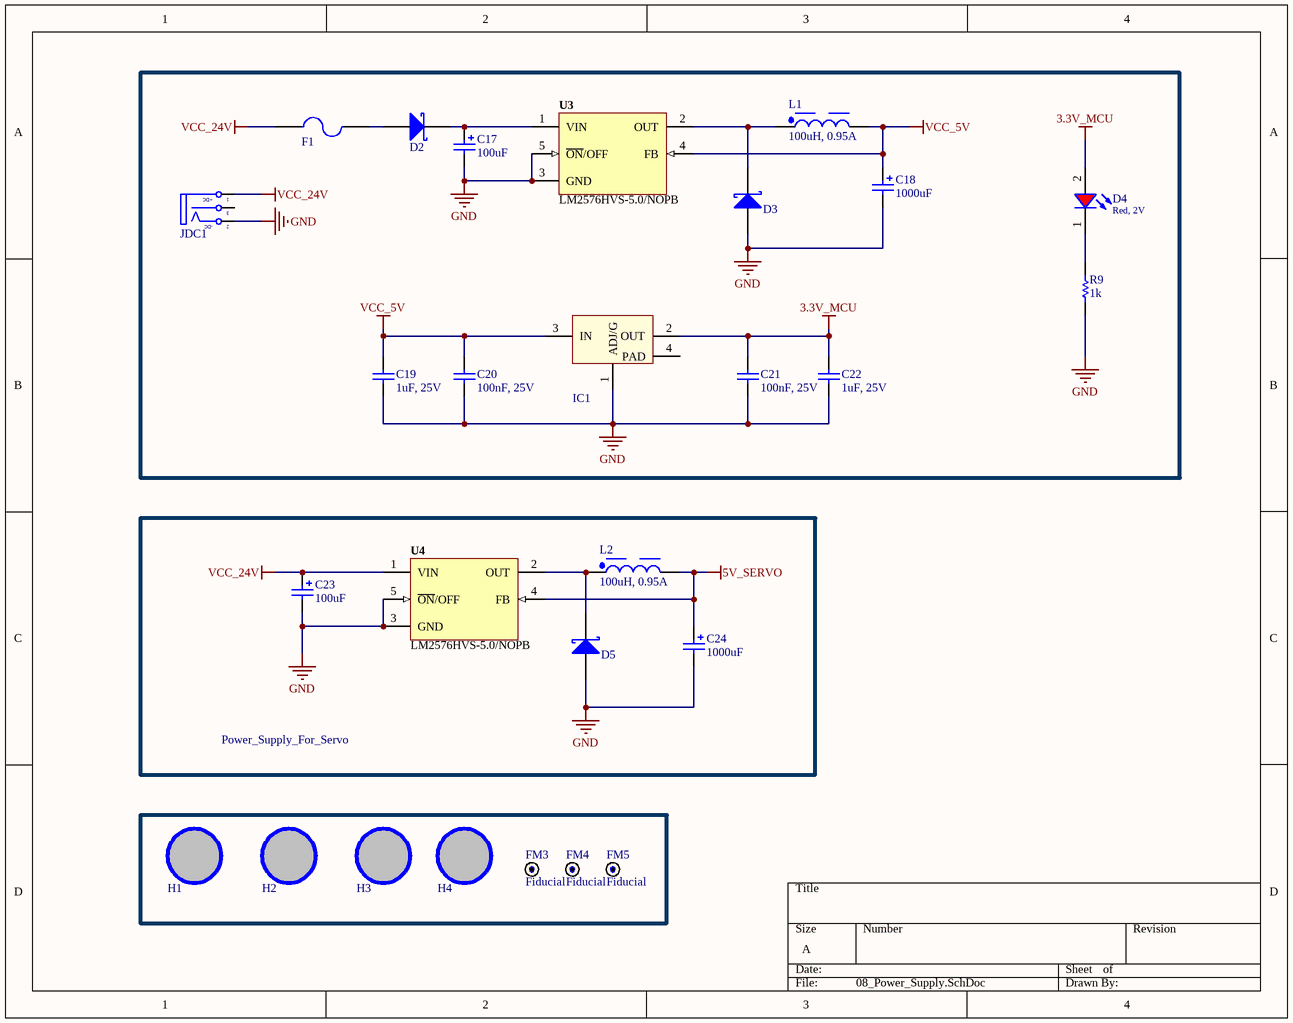
[diagram p7: 08_Power_Supply.SchDoc]

### Parts
C17  100uF  [WCAP-ATG8_D6.3H11]
C18  1000uF  [WCAP-ATG8_D10H20]
C19  1uF, 25V  [WCAP-CSGP_0603_H=0.8mm_Reflow]
C20  100nF, 25V  [WCAP-CSGP_0603_H=0.8mm_Reflow]
C21  100nF, 25V  [WCAP-CSGP_0603_H=0.8mm_Reflow]
C22  1uF, 25V  [WCAP-CSGP_0603_H=0.8mm_Reflow]
C23  100uF  [WCAP-ATG8_D6.3H11]
C24  1000uF  [WCAP-ATG8_D10H20]
D2  SS34  [SS34]  (value not drawn)
D3  SS34  [SS34]  (value not drawn)
D4  Red, 2V  [WL-SMCW_0603_H=0.7mm]
D5  SS34  [SS34]  (value not drawn)
F1  0ZCG0150BF2C  [FUSE SMD]  (value not drawn)
FM3  Fiducial  [FUDICIAL_MARKER]  (no BOM)
FM4  Fiducial  [FUDICIAL_MARKER]  (no BOM)
FM5  Fiducial  [FUDICIAL_MARKER]  (no BOM)
H1  Hole  [LO KHOAN 3MM]  (value not drawn)  (no BOM)
H2  Hole  [LO KHOAN 3MM]  (value not drawn)  (no BOM)
H3  Hole  [LO KHOAN 3MM]  (value not drawn)  (no BOM)
H4  Hole  [LO KHOAN 3MM]  (value not drawn)  (no BOM)
IC1  LM1117IMP-3.3/NOPB  [SOT223-4N]  (value not drawn)
JDC1  G-014-4  [DC-IN]  (value not drawn)
L1  100uH, 0.95A  [WE-PD2SR_7850]
L2  100uH, 0.95A  [WE-PD2SR_7850]
R9  value 1k  [RES-SM-0603]  (hidden comment: ESR03EZPJ102)
U3  LM2576HVS-5.0/NOPB  [TO263]
U4  LM2576HVS-5.0/NOPB  [TO263]

### Blocks framed on the sheet
Power_Supply_For_Servo: C23 C24 D5 L2 U4

### Nets
3.3V_MCU: C21.2 C22.2 D4.2(A) IC1.2(OUT)
5V_SERVO: C24.1(P) L2.2 U4.4(FB)
GND: C17.2(N) C18.2(N) C19.2 C20.1 C21.1 C22.1 C23.2(N) C24.2(N) D3.1(A) D5.1(A) IC1.1(ADJ/G) JDC1.2(TN) R9.1 U3.3(GND) U3.5(~{ON}/OFF) U4.3(GND) U4.5(~{ON}/OFF)
VCC_5V: C18.1(P) C19.1 C20.2 IC1.3(IN) L1.2 U3.4(FB)
VCC_24V: C23.1(P) F1.1 JDC1.1(T) U4.1(VIN)
NetC17_1: C17.1(P) D2.2(K) U3.1(VIN)
NetD2_1: D2.1(A) F1.2
NetD3_2: D3.2(K) L1.1 U3.2(OUT)
NetD4_1: D4.1(K) R9.2
NetD5_2: D5.2(K) L2.1 U4.2(OUT)

Not connected (* = marked no-connect by the designer): H1 1; H2 1; H3 1; H4 1; IC1 4(PAD); JDC1 3(S)

### Notes on the sheet
- (in symbol Jack DC) +DC; -DC

### Library data of the parts
C17 C23 = 860010473007: WCAP-ATG8 Aluminum Electrolytic Capacitor, Radial THT, D6.3xH11mm, 100uF, 25V; Manufacturer: Wurth Elektronik; Capacitance Tolerance: +/-20%; Dissipation Factor: 14%; Endurance: 2000h; Leakage Current: 25uA; Ripple Current: 209mA; Technical Reference: ATBD110101M025DSPA4B000; No. Pad (SMD): 0; No. Pad (THT): 2; ComponentLink1Description: Manufacturer Link; ComponentLink1URL: https://www.we-online.com/redexpert/article/860010473007?ad; ComponentLink2Description: Datasheet; ComponentLink2URL: https://www.we-online.com/redexpert/spec/860010473007?ad; Category: Aluminum Electrolytic Capacitors; Match Code: WCAP-ATG8; Manufacturer Part Number: 860010473007; Mount: Through Hole; Operating Temperature Max: 85°C; Operating Temperature Min: -40°C; Packaging: Ammo Pack; Height: 11mm; Diameter: 6.3mm; Capacitance: 100uF; Rated Voltage (DC): 25V; Unit Price (Digikey): 0.13
C18 C24 = 860010475017: WCAP-ATG8 Aluminum Electrolytic Capacitor, Radial THT, D10xH20mm, 1000uF, 25V; Manufacturer: Wurth Elektronik; Capacitance Tolerance: +/-20%; Dissipation Factor: 14%; Endurance: 2000h; Leakage Current: 250uA; Ripple Current: 1050mA; Technical Reference: ATBF200102M025DSPAAB000; No. Pad (SMD): 0; No. Pad (THT): 2; ComponentLink1Description: Manufacturer Link; ComponentLink1URL: https://www.we-online.com/redexpert/article/860010475017?ad; ComponentLink2Description: Datasheet; ComponentLink2URL: https://www.we-online.com/redexpert/spec/860010475017?ad; Category: Aluminum Electrolytic Capacitors; Match Code: WCAP-ATG8; Manufacturer Part Number: 860010475017; Mount: Through Hole; Operating Temperature Max: 85°C; Operating Temperature Min: -40°C; Packaging: Ammo Pack; Height: 20mm; Diameter: 10mm; Capacitance: 1000uF; Rated Voltage (DC): 25V; Unit Price (Digikey): 0.57
C19 C22 = 885012106022: WCAP-CSGP Multilayer Ceramic Chip Capacitor, General Purpose, size 0603, X5R, 1uF, 25V; Manufacturer: Wurth Elektronik; Rated Voltage: 25VDC; Isolation Resistance: >=0.5GOhm; Capacitance Tolerance: +/-20%; Technical Reference: X5R0603105M025DFCT10000; No. Pad (SMD): 2; No. Pad (THT): 0; ComponentLink1Description: Manufacturer; ComponentLink1URL: http://www.we-online.de; ComponentLink2Description: Datasheet; ComponentLink2URL: https://www.we-online.com/catalog/datasheet/885012106022.pdf; Operating Temperature: -55 to +85degC; Packaging: Tape and Reel; Manufacturer Part Number: 885012106022; Published Date: May 2020; Ceramic Type: X5R; Dissipation Factor: =<10%; Height: 0.8mm; Mounting Technology: SMT; Size: 0603; Capacitance: 1uF; Unit Price (Digikey): 0.43
C20 C21 = 885012206071: WCAP-CSGP Multilayer Ceramic Chip Capacitor, General Purpose, size 0603, X7R, 100nF, 25V; Manufacturer: Wurth Elektronik; Rated Voltage: 25VDC; Isolation Resistance: >=5GOhm; Capacitance Tolerance: +/-10%; Technical Reference: X7R0603104K025DFCT10000; No. Pad (SMD): 2; No. Pad (THT): 0; ComponentLink1Description: Manufacturer; ComponentLink1URL: http://www.we-online.de; ComponentLink2Description: Datasheet; ComponentLink2URL: https://www.we-online.com/catalog/datasheet/885012206071.pdf; Operating Temperature: -55 to +125degC; Packaging: Tape and Reel; Manufacturer Part Number: 885012206071; Published Date: May 2020; Ceramic Type: X7R; Dissipation Factor: =<3.5%; Height: 0.8mm; Mounting Technology: SMT; Size: 0603; Capacitance: 100nF; Unit Price (Digikey): 0.1
D2 D3 D5 = D Schottky: DIODE SCHOTTKY 40V 3A SMC; Mfr: onsemi; No. Pad (SMD): 2; No. Pad (THT): 0; Voltage - Forward (Vf) (Max) @ If: 500 mV @ 3 A; Speed: Fast Recovery =< 500ns, > 200mA (Io); Current - Reverse Leakage @ Vr: 500 µA @ 40 V; Published: 8-Jun-2000; LatestRevisionDate: 17-Jul-2002; LatestRevisionNote: Re-released for DXP Platform.; PackageReference: SMB; Publisher: Altium Limited; PackageDescription: DO-214-AA/SMB; 2 C-Bend Leads; Body 5.3 x 3.6 mm, inc. leads (LxW); Code_JEDEC: DO-214-AA; Unit Price (Digikey): 0.65; Category: Discrete Semiconductor Products; Diode Type: Schottky; Voltage - DC Reverse (Vr) (Max): 40 V; Current - Average Rectified (Io): 3A; Mounting Type: Surface Mount; Package / Case: DO-214AB, SMC*; Supplier Device Package: SMC (DO-214AB); Operating Temperature - Junction: -55°C ~ 150°C; Base Product Number: SS34
D4 = 150060RS75000: WL-SMCW SMT Mono-color Chip LED Waterclear, size 0603, Red, 2V, 140deg; Chip Technology: AlInGaP; Dominant Wavelength typ.: 625nm; Luminous Intensity typ.: 250mcd; Peak Wavelength typ.: 630nm; No. Pad (SMD): 2; No. Pad (THT): 0; Viewing Angle: 140deg; ComponentLink1Description: Manufacturer; ComponentLink1URL: http://www.we-online.de; ComponentLink2URL: https://www.we-online.com/catalog/datasheet/150060RS75000.pdf; ComponentLink2Description: Datasheet; Forward Voltage typ.: 2V; Emitting Color: Red; Mounting Technology: SMT; Operating Temperature: -40 to +85degC; Published Date: December 2019; Part Number: 150060RS75000; Packaging: Tape and Reel; Size: 0603; Publisher: Wurth Elektronik; Unit Price (Digikey): 0.15
F1 = Fuse: Polymeric PTC Resettable Fuse 24V 1.5 A Ih Surface Mount 1812 (4532 Metric), Concave; Mfr: Bel Fuse Inc.; No. Pad (SMD): 2; No. Pad (THT): 0; Current - Max: 100 A; Current - Hold (Ih) (Max): 1.5 A; Current - Trip (It): 3 A; Time to Trip: 1.5 s; Resistance - Initial (Ri) (Min): 40 mOhms; Resistance - Post Trip (R1) (Max): 120 mOhms; Approval Agency: AEC-Q200, cURus, TUV; Unit Price (Digikey): 0.23; Category: Circuit Protection; Series: 0ZCG; Type: Polymeric; Voltage - Max: 24V; Operating Temperature: -40°C ~ 85°C; Ratings: AEC-Q200; Mounting Type: Surface Mount; Package / Case: 1812 (4532 Metric), Concave; Size / Dimension: 0.179" L x 0.128" W (4.55mm x 3.24mm); Thickness (Max): 0.061" (1.55mm); ComponentLink1Description: Digikey; ComponentLink1URL: https://www.digikey.com/en/products/detail/bel-fuse-inc/0ZCG0150BF2C/4156109?s=N4IgTCBcDaIAwC0DCBxOBGArHAQgMTCRAF0BfIA
H1-H4 = Hole: Hole 3mm
IC1 = LM1117: Linear Voltage Regulator IC Positive Fixed 1 Output 800mA SOT-223; Mfr: Texas Instruments; Value: LM317; No. Pad (SMD): 4; No. Pad (THT): 0; Number of Regulators: 1; Voltage - Input (Max): 15V; Voltage - Output (Min/Fixed): 3.3V; Voltage Dropout (Max): 1.2V @ 800mA; Current - Quiescent (Iq): 5 mA; Current - Supply (Max): 10 mA; PSRR: 75dB (120Hz); Protection Features: Over Current, Over Temperature; Unit Price (Digikey): 1.41; Category: Integrated Circuits (ICs); Output Configuration: Positive; Output Type: Fixed; Current - Output: 800mA; Operating Temperature: -40°C ~ 125°C; Mounting Type: Surface Mount; Package / Case: TO-261-4, TO-261AA; Supplier Device Package: SOT-223; Base Product Number: LM1117
JDC1 = Jack DC: DC POWER JACK, MATES TO 5.5 X 2.; Mfr: GlobTek, Inc.; Value: Jac DC; No. Pad (SMD): 0; No. Pad (THT): 3; Gender: Male; Industry Recognized Mating Diameter: 2.10mm ID (0.083"), 5.50mm OD (0.217"); Actual Diameter: 0.083" (2.10mm ID), 0.217" (5.50mm OD); Number of Positions/Contacts: 2 Conductors, 3 Contacts; Internal Switch(s): Single Switch; Shielding: Shielded; Voltage - Rated: 24VDC; Current Rating (Amps): 5 A; Unit Price (Digikey): 1.02; Category: Connectors, Interconnects; Connector Type: Jack; Mounting Type: Through Hole, Right Angle; Termination: Kinked Pin, Solder; Insulation Color: Black; Contact Material - Plating: Nickel; Housing Material: Polybutylene Terephthalate (PBT), Glass Filled; Contact Material: Brass
L1 L2 = 744787101: WE-PD2SR SMT Power Inductor, size 7850, 100uH, 0.95A, 467mOhm; Manufacturer: Wurth Elektronik; Self Resonant Frequency: 5MHz; DC Resistance typ.: 396mOhm; Saturation Current: 0.87A; No. Pad (SMD): 2; No. Pad (THT): 0; ComponentLink1Description: Manufacturer; ComponentLink1URL: http://www.we-online.de; ComponentLink2Description: Datasheet; ComponentLink2URL: https://www.we-online.com/catalog/datasheet/744787101.pdf; Mounting Technology: SMT; Operating Temperature: -40 to +125degC; Packaging: Tape and Reel; Height: 5mm; DC Resistance max.: 467mOhm; Inductance: 100uH; Manufacturer Part Number: 744787101; Rated Current: 0.95A; Size: 7850; Length: 7.8mm; Width: 7mm; Unit Price (Digikey): 1.95
R9 = RESISTOR SMD: RES SMD 1K OHM 5% 1/4W 0603; Mfr: Rohm Semiconductor; No. Pad (SMD): 2; No. Pad (THT): 0; Resistance: 1 kOhms; Power (Watts): 0.25W, 1/4W; Temperature Coefficient: ±200ppm/°C; Unit Price (Digikey): 0.14; Series: ESR; Tolerance: ±5%; Composition: Thick Film; Features: Automotive AEC-Q200, Pulse Withstanding; ComponentLink1Description: Digikey; ComponentLink1URL: https://www.digikey.com/en/products/detail/rohm-semiconductor/ESR03EZPJ102/1762721?s=N4IgTCBcDaIKIGUBKAGAzHAWgBQFIEYUIBdAXyA; Operating Temperature: -55°C ~ 155°C; Package / Case: 0603 (1608 Metric); Supplier Device Package: 0603; Ratings: AEC-Q200; Size / Dimension: 0.063" L x 0.031" W (1.60mm x 0.80mm); Number of Terminations: 2; Height - Seated (Max): 0.022" (0.55mm)
U3 U4 = LM2576: IC REG BUCK 5V 3A TO263-5; Mfr: Texas Instruments; No. Pad (SMD): 6; No. Pad (THT): 0; Function: Step-Down; Output Configuration: Positive; Output Type: Fixed; Number of Outputs: 1; Voltage - Input (Min): 4V; Voltage - Input (Max): 60V; Frequency - Switching: 52kHz; Synchronous Rectifier: No; Category: IC-Power; Unit Price (Digikey): 9.24; Series: SIMPLE SWITCHER®; Topology: Buck; Voltage - Output (Min/Fixed): 5V; Current - Output: 3A; Operating Temperature: -40°C ~ 125°C (TJ); Mounting Type: Surface Mount; Package / Case: TO-263-6, D²Pak (5 Leads + Tab), TO-263BA; Supplier Device Package: DDPAK/TO-263-5; Base Product Number: LM2576
  U3: ComponentLink1Description: New link; ComponentLink1URL: *

## Nets that join several sheets
3.3V_MCU: 03_MCU (14 pins), 04_Input (J1.1 J2.1), 05_Output (Q1.1 R3.1), 06_ESP (9 pins), 08_Power_Supply (C21.2 C22.2 D4.2 IC1.2)
5V_SERVO: 05_Output (J8.2 R2.2), 08_Power_Supply (C24.1 L2.2 U4.4)
GND: 03_MCU (21 pins), 04_Input (5 pins), 05_Output (J7.2 J8.3 J10.2), 06_ESP (10 pins), 07_Power_Supply_AC_to_DC (8 pins), 08_Power_Supply (17 pins)
VCC_5V: 04_Input (J4.4 J5.4 J6.4), 05_Output (J7.1), 08_Power_Supply (6 pins)
VCC_24V: 05_Output (J10.1), 07_Power_Supply_AC_to_DC (5 pins), 08_Power_Supply (C23.1 F1.1 JDC1.1 U4.1)
NetJ1_3: 03_MCU (U1.15), 04_Input (J1.3)
NetJ2_3: 03_MCU (U1.16), 04_Input (J2.3)
NetJ3_1: 03_MCU (U1.25), 04_Input (J3.1)
NetJ3_2: 03_MCU (U1.26), 04_Input (J3.2)
NetJ3_3: 03_MCU (U1.27), 04_Input (J3.3)
NetJ3_4: 03_MCU (U1.28), 04_Input (J3.4)
NetJ3_5: 03_MCU (U1.29), 04_Input (J3.5)
NetJ3_6: 03_MCU (U1.30), 04_Input (J3.6)
NetJ3_7: 03_MCU (U1.31), 04_Input (J3.7)
NetJ3_8: 03_MCU (U1.32), 04_Input (J3.8)
NetJ4_2: 03_MCU (U1.17), 04_Input (J4.2)
NetJ4_3: 03_MCU (U1.18), 04_Input (J4.3)
NetJ5_2: 03_MCU (U1.19), 04_Input (J5.2)
NetJ5_3: 03_MCU (U1.20), 04_Input (J5.3)
NetJ6_2: 03_MCU (U1.21), 04_Input (J6.2)
NetJ6_3: 03_MCU (U1.22), 04_Input (J6.3)
NetJ7_3: 03_MCU (U1.35), 05_Output (J7.3)
NetJ7_4: 03_MCU (U1.36), 05_Output (J7.4)
NetJ9_1: 03_MCU (U1.39), 05_Output (J9.1)
NetJ9_2: 03_MCU (U1.40), 05_Output (J9.2)
NetJ9_3: 03_MCU (U1.41), 05_Output (J9.3)
NetQ1_3: 03_MCU (U1.14), 05_Output (Q1.3 R3.2)